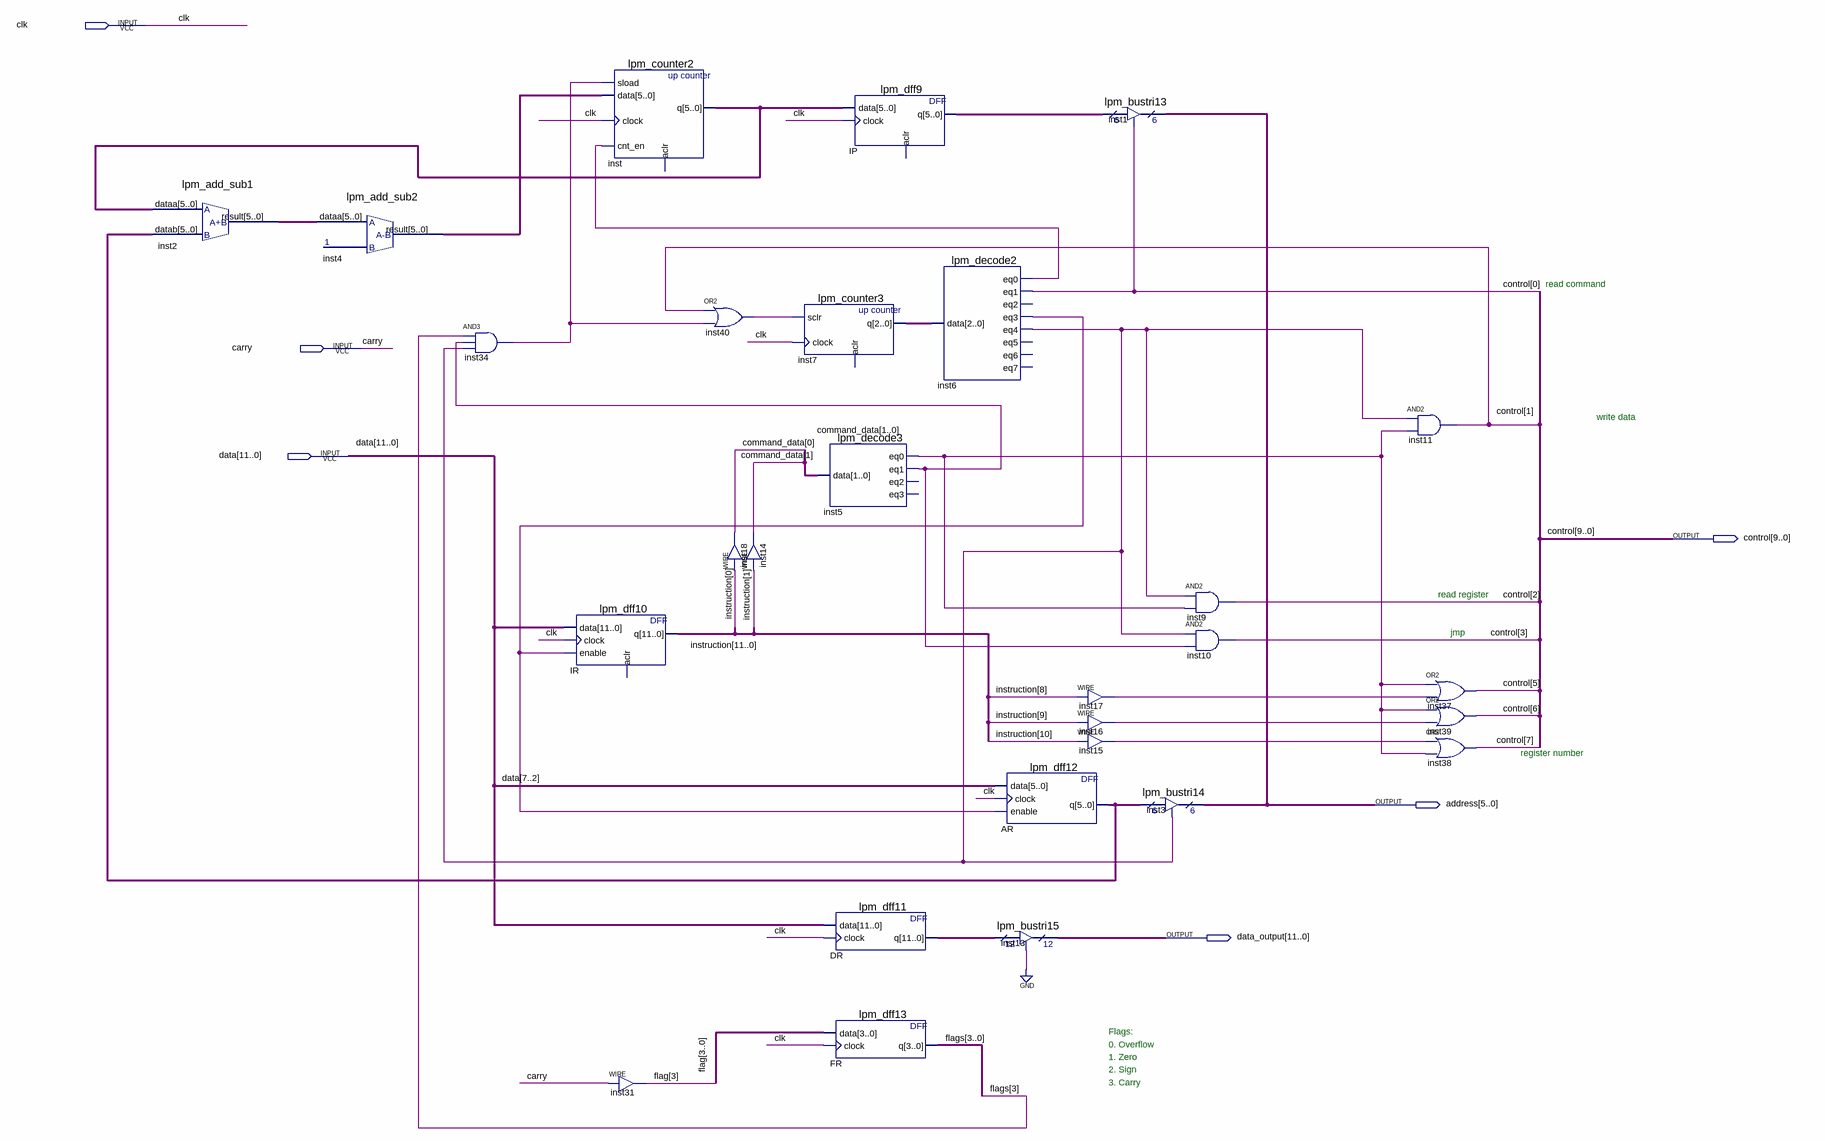
[diagram p0: schematic sheet]
// Quartus schematic controlUnit.bdf as structural Verilog: 28 symbols, 6 pins
module controlUnit (
  input  clk,
  input  carry,
  input  [11:0] data,
  output [9:0] control,
  output [5:0] address,
  output [11:0] data_output
);

  wire inst5_eq0, inst5_eq1, inst6_eq0, inst6_eq3, inst6_eq4, inst15_out, inst16_out, inst17_out, inst34_out,
       inst40_out;
  wire [1:0] command_data;
  wire [2:0] inst7_q;
  wire [3:0] flag, flags;
  wire [5:0] AR_q, inst2_result, inst4_result, inst_q, IP_q;
  wire [11:0] DR_q, instruction;

  lpm_add_sub1 inst2 (.dataa(inst_q), .datab(AR_q), .result(inst2_result));
  lpm_add_sub2 inst4 (.dataa(inst2_result), .result(inst4_result));
  and inst34 (inst34_out, flags[3], inst5_eq1, inst6_eq4);
  lpm_dff10 IR (.data(data), .clock(clk), .enable(inst6_eq3), .q(instruction));  // open: aclr
  lpm_counter2 inst (
    .sload(inst34_out), .data(inst4_result), .clock(clk), .cnt_en(inst6_eq0), .q(inst_q));  // open: aclr
  assign flag[3] = carry;  // WIRE inst31
  or inst40 (inst40_out, control[1], inst34_out);
  assign command_data[0] = instruction[0];  // WIRE inst18
  assign command_data[1] = instruction[1];  // WIRE inst14
  lpm_counter3 inst7 (.sclr(inst40_out), .clock(clk), .q(inst7_q));  // open: aclr
  lpm_decode3 inst5 (.data(command_data), .eq0(inst5_eq0), .eq1(inst5_eq1));  // open: eq2, eq3
  lpm_dff11 DR (.data(data), .clock(clk), .q(DR_q));
  lpm_dff13 FR (.data(flag), .clock(clk), .q(flags));
  lpm_dff9 IP (.data(inst_q), .clock(clk), .q(IP_q));  // open: aclr
  lpm_decode2 inst6 (
    .data(inst7_q), .eq0(inst6_eq0), .eq1(control[0]), .eq3(inst6_eq3), .eq4(inst6_eq4));  // open: eq2, eq5, eq6, eq7
  lpm_dff12 AR (.data(data[7:2]), .clock(clk), .enable(inst6_eq3), .q(AR_q));
  lpm_bustri15 inst13 (.enabledt(1'b0), .data(DR_q), .tridata(data_output));
  assign inst17_out = instruction[8];  // WIRE inst17
  assign inst16_out = instruction[9];  // WIRE inst16
  assign inst15_out = instruction[10];  // WIRE inst15
  lpm_bustri13 inst1 (.enabledt(control[0]), .data(IP_q), .tridata(address));
  lpm_bustri14 inst3 (.enabledt(inst6_eq4), .data(AR_q), .tridata(address));
  and inst9 (control[2], inst6_eq4, inst5_eq0);
  and inst10 (control[3], inst6_eq4, inst5_eq1);
  and inst11 (control[1], inst6_eq4, inst5_eq0);
  or inst37 (control[5], inst5_eq0, inst17_out);
  or inst39 (control[6], inst5_eq0, inst16_out);
  or inst38 (control[7], inst15_out, inst5_eq0);

  // Notes on the sheet:
  //   read command
  //   write data
  //   read register
  //   jmp
  //   register number
  //   Flags:
  //   0. Overflow
  //   1. Zero
  //   2. Sign
  //   3. Carry
endmodule
